# EAGLE design bmscableL431 (EAGLE 6.5.0)
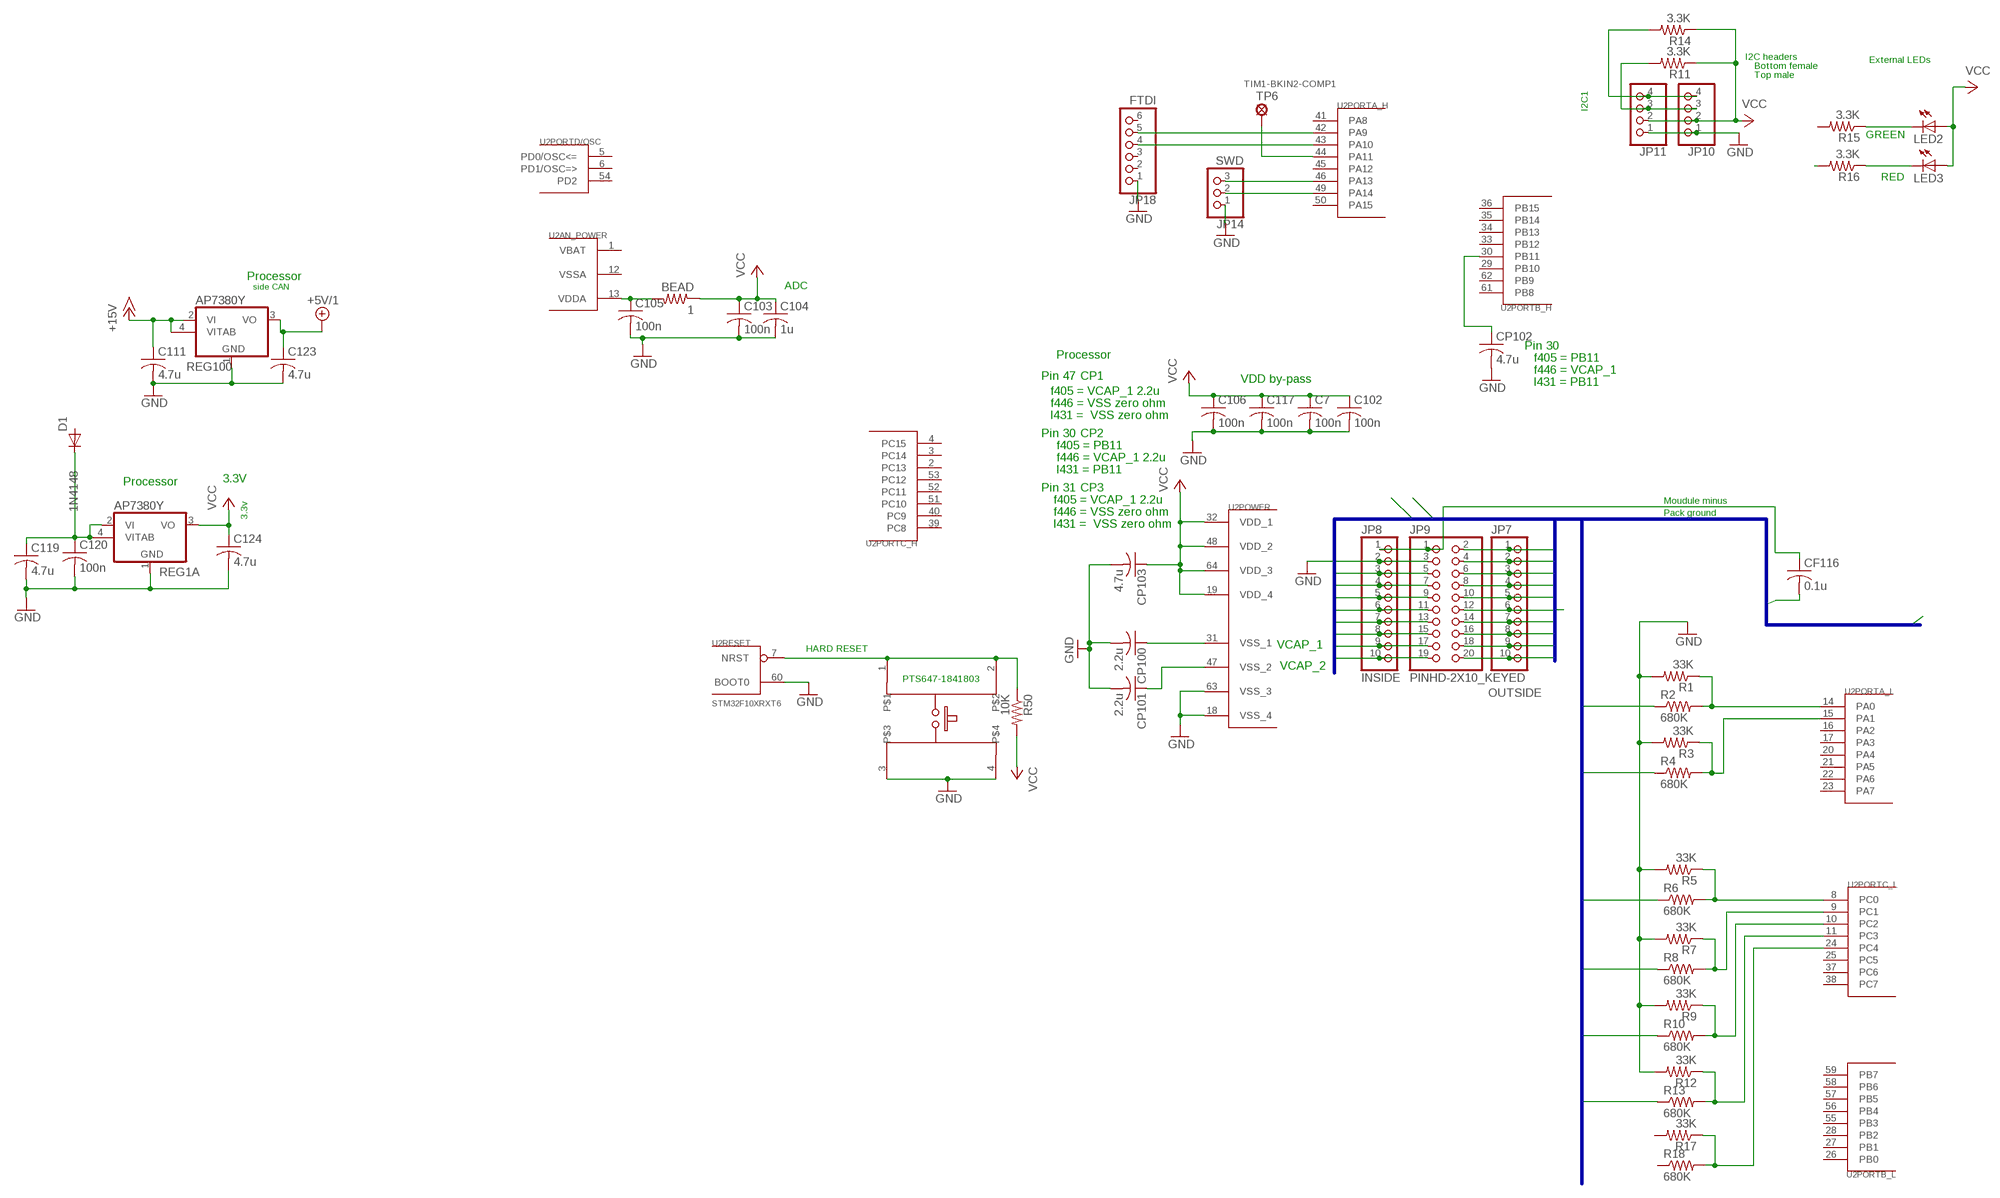
[diagram p0: schematic, sheet 1]

## Parts
BEAD  1  R-US_R0603  [R0603]
C7  100n  C-USC0603  [C0603]
C102  100n  C-USC0603  [C0603]
C103  100n  C-USC0603  [C0603]
C104  1u  C-USC0603  [C0603]
C105  100n  C-USC0603  [C0603]
C106  100n  C-USC0603  [C0603]
C111  4.7u  C-USC0603  [C0603]
C117  100n  C-USC0603  [C0603]
C119  4.7u  C-USC0603  [C0603]
C120  100n  C-USC0603  [C0603]
C123  4.7u  C-USC0603  [C0603]
C124  4.7u  C-USC0805  [C0805]
CF116  0.1u  C-USC0603  [C0603]
CP100  2.2u  C-USC0603  [C0603]
CP101  2.2u  C-USC0603  [C0603]
CP102  4.7u  C-USC0603  [C0603]
CP103  4.7u  C-USC0603  [C0603]
D1  1N4148  1N4004_VERT  [DO41-10_VERT]
JP7  OUTSIDE  PINHD-1X10  [1X10]
JP8  INSIDE  PINHD-1X10  [1X10]
JP9  PINHD-2X10_KEYED  [2X10_KEYED]
JP10  PINHD-1X4  [1X04]
JP11  PINHD-1X4  [1X04]
JP14  SWD  PINHD-1X3  [1X03]
JP18  FTDI  PINHD-1X6  [1X06]
LED2  LEDCHIP-LED0603  [CHIP-LED0603]
LED3  LEDCHIP-LED0603  [CHIP-LED0603]
R1  33K  R-US_R0603  [R0603]
R2  680K  R-US_R0603  [R0603]
R3  33K  R-US_R0603  [R0603]
R4  680K  R-US_R0603  [R0603]
R5  33K  R-US_R0603  [R0603]
R6  680K  R-US_R0603  [R0603]
R7  33K  R-US_R0603  [R0603]
R8  680K  R-US_R0603  [R0603]
R9  33K  R-US_R0603  [R0603]
R10  680K  R-US_R0603  [R0603]
R11  3.3K  R-US_R0603  [R0603]
R12  33K  R-US_R0603  [R0603]
R13  680K  R-US_R0603  [R0603]
R14  3.3K  R-US_R0603  [R0603]
R15  3.3K  R-US_R0603  [R0603]
R16  3.3K  R-US_R0603  [R0603]
R17  33K  R-US_R0603  [R0603]
R18  680K  R-US_R0603  [R0603]
R50  10K  R-US_R0603  [R0603]
REG1A  AP7380Y  [SOT89]
REG100  AP7380Y  [SOT89]
TP6  SOLDPAD0.6MM  [SOLPAD.6MM]
U2  STM32F10XRXT6  [TQFP64]
U$1  E-SWITCH2  [E-SWITCH2]

## Nets
+5V/1: C123.1 REG100.3(VO)
+15V: C111.1 REG100.2(VI) REG100.4(VITAB)
C0: JP7.2 JP9.4
C1: JP8.7 JP9.13
C2: JP8.3 JP9.5
C3: JP7.7 JP9.14 R4.1
C4: JP7.3 JP9.6
C5: JP8.8 JP9.15 R2.1
C6: JP8.4 JP9.7
C7: JP7.8 JP9.16 R13.1
C8: JP7.4 JP9.8
C9: JP8.9 JP9.17 R10.1
C10: JP8.5 JP9.9
C11: JP7.9 JP9.18 R8.1
C12: JP7.5 JP9.10
C13: JP8.10 JP9.19 R6.1
C14: JP8.6 JP9.11
C15: JP7.10 JP9.20
C16: JP7.6 JP9.12
GND: C7.2 C102.2 C103.2 C104.2 C105.2 C106.2 C111.2 C117.2 C119.2 C120.2 C123.2 C124.2 CP100.2 CP101.2 CP102.2 CP103.2 JP8.2 JP9.3 JP10.1 JP11.1 JP14.1 JP18.1 R1.2 R3.2 R5.2 R7.2 R9.2 R12.2 REG1A.1(GND) REG100.1(GND) U2.18(POWER:VSS_4) U2.60(RESET:BOOT0) U2.63(POWER:VSS_3) U$1.3 U$1.4
LED-EXT-GRN-CATHODE: LED2.C R15.1
LED-EXT-RED-CATHODE: LED3.C R16.1
NRST: R50.1 U2.7(RESET:NRST) U$1.1 U$1.2
PA0-C5-IN5: R1.1 R2.2 U2.14(PORTA_L:PA0)
PA1-C3-IN6: R3.1 R4.2 U2.15(PORTA_L:PA1)
PA9-USART1-TX: JP18.5 U2.42(PORTA_H:PA9)
PA10-USART1-RX: JP18.4 U2.43(PORTA_H:PA10)
PA13-SWDIO: JP14.3 U2.46(PORTA_H:PA13)
PA14-SWCLK: JP14.2 U2.49(PORTA_H:PA14)
PB1-LED-RED: R16.2
PB6-I2C1-SCL: JP10.4 JP11.4 R14.2
PB7-I2C2-SDA: JP10.3 JP11.3 R11.2
PB11-I2C2-SDA|VCAP1: CP102.1 U2.30(PORTB_H:PB11)
PC0-C13-IN1: R5.1 R6.2 U2.8(PORTC_L:PC0)
PC1-C11-IN2: R7.1 R8.2 U2.9(PORTC_L:PC1)
PC2-C9-IN3: R9.1 R10.2 U2.10(PORTC_L:PC2)
PC3-C7-IN4: R12.1 R13.2 U2.11(PORTC_L:PC3)
PC4-CX-IN13: R17.1 R18.2 U2.24(PORTC_L:PC4)
PGND_SRN_V: CF116.1 JP8.1 JP9.1
SRP: CF116.2 JP7.1 JP9.2
TIM1_BKIN2_COMP2: TP6.MP U2.44(PORTA_H:PA11)
V-ORED: C119.1 C120.1 D1.C REG1A.2(VI) REG1A.4(VITAB)
VCC: BEAD.1 C7.1 C102.1 C103.1 C104.1 C106.1 C117.1 C124.1 CP103.1 JP10.2 JP11.2 LED2.A LED3.A R11.1 R14.1 R50.2 REG1A.3(VO) U2.19(POWER:VDD_4) U2.32(POWER:VDD_1) U2.48(POWER:VDD_2) U2.64(POWER:VDD_3)
VDDA1: BEAD.2 C105.1 U2.13(AN_POWER:VDDA)
VSS_1-VCAP_1: CP100.1 U2.31(POWER:VSS_1)
VSS_3: CP101.1 U2.47(POWER:VSS_2)
Unconnected: D1.A JP18.2 JP18.3 JP18.6 R15.2 R17.2 R18.1 U2.2(PORTC_H:PC13) U2.3(PORTC_H:PC14) U2.4(PORTC_H:PC15) U2.5(PORTD/OSC:PD0/OSC<=) U2.6(PORTD/OSC:PD1/OSC=>) U2.16(PORTA_L:PA2) U2.17(PORTA_L:PA3) U2.20(PORTA_L:PA4) U2.21(PORTA_L:PA5) U2.22(PORTA_L:PA6) U2.23(PORTA_L:PA7) U2.25(PORTC_L:PC5) U2.26(PORTB_L:PB0) U2.27(PORTB_L:PB1) U2.28(PORTB_L:PB2) U2.29(PORTB_H:PB10) U2.33(PORTB_H:PB12) U2.34(PORTB_H:PB13) U2.35(PORTB_H:PB14) U2.36(PORTB_H:PB15) U2.37(PORTC_L:PC6) U2.38(PORTC_L:PC7) U2.39(PORTC_H:PC8) U2.40(PORTC_H:PC9) U2.41(PORTA_H:PA8) U2.45(PORTA_H:PA12) U2.50(PORTA_H:PA15) U2.51(PORTC_H:PC10) U2.52(PORTC_H:PC11) U2.53(PORTC_H:PC12) U2.54(PORTD/OSC:PD2) U2.55(PORTB_L:PB3) U2.56(PORTB_L:PB4) U2.57(PORTB_L:PB5) U2.58(PORTB_L:PB6) U2.59(PORTB_L:PB7) U2.61(PORTB_H:PB8) U2.62(PORTB_H:PB9)

## Buses
HDR$:PGND-SRN,SRP,VSS,C[0..16]

## Notes on the sheet
- I2C headers
- External LEDs
- Bottom female
- Top male
- TIM1-BKIN2-COMP1
- I2C1
- GREEN
- RED
- Processor
- side CAN | ADC
- Pin 30
- Processor | f405 = PB11
- f446 = VCAP_1
- Pin 47 | CP1 | VDD by-pass
- l431 = PB11
- f405 = VCAP_1 2.2u
- f446 = VSS zero ohm
- l431 =  VSS zero ohm
- Pin 30 | CP2
- f405 = PB11
- f446 = VCAP_1 2.2u
- l431 = PB11
- Processor | 3.3V
- Pin 31 | CP3
- 3.3v
- f405 = VCAP_1 2.2u | Moudule minus
- f446 = VSS zero ohm | Pack ground
- l431 =  VSS zero ohm
- VCAP_1
- HARD | RESET
- VCAP_2
- PTS647-1841803

## Power pins joined to a net without a drawn wire
VBAT: U2.1(AN_POWER:VBAT)
VSSA: U2.12(AN_POWER:VSSA)

## Library data of the parts
BEAD R1-R18 R50 = rcl:R-US_: RESISTOR, American symbol
C7 C102-C106 C111 C117 C119 C120 C123 C124 CF116 CP100-CP103 = rcl:C-US: CAPACITOR, American symbol
D1 = diode:1N4004_VERT
JP7 JP8 = pinhead:PINHD-1X10: PIN HEADER
JP9 = pinhead:PINHD-2X10_KEYED
JP10 JP11 = pinhead:PINHD-1X4: PIN HEADER
JP14 = pinhead:PINHD-1X3: PIN HEADER
JP18 = pinhead:PINHD-1X6: PIN HEADER
LED2 LED3 = led:LED: LED OSRAM: - CHIPLED LG R971, LG N971, LY N971, LG Q971, LY Q971, LO R971, LY R971 LH N974, LH R974 LS Q976, LO Q976, LY Q976 LO Q996 - Hyper CHIPLED LW Q18S LB Q993, LB Q99A, LB R99A - SideLED LS A670, LO A670, LY A670, LG A670, LP A670 LB A673, LV A673, LT A673, LW A673 LH A674 LY A675 LS A676, LA A676, LO A676, LY A676, LW A676 LS A679, LY A679, LG A679 - Hyper Micro SIDELED® LS Y876, LA Y876, LO Y876, LY Y876 LT Y87S - SmartLED LW L88C, LW L88S LB L89C, LB L89S, LG L890 LS L89K, LO L89K, LY L89K LS L896, LA L896, LO L896, LY L896 - TOPLED LS T670, LO T670, LY T670, LG T670, LP T670 LSG T670, LSP T670, LSY T670, LOP T670, LYG T670 LG T671, LOG T671, LSG T671 LB T673, LV T673, LT T673, LW T673 LH T674 LS T676, LA T676, LO T676, LY T676, LB T676, LH T676, LSB T676, LW T676 LB T67C, LV T67C, LT T67C, LS T67K, LO T67K, LY T67K, LW E67C LS E67B, LA E67B, LO E67B, LY E67B, LB E67C, LV E67C, LT E67C LW T67C LS T679, LY T679, LG T679 LS T770, LO T770, LY T770, LG T770, LP T770 LB T773, LV T773, LT T773, LW T773 LH T774 LS E675, LA E675, LY E675, LS T675 LS T776, LA T776, LO T776, LY T776, LB T776 LHGB T686 LT T68C, LB T68C - Hyper Mini TOPLED® LB M676 - Mini TOPLED Santana® LG M470 LS M47K, LO M47K, LY M47K Source: http://www.osram.convergy.de/
REG1A REG100 = linear:AP7380Y
TP6 = solpad:SOLDPAD0.6MM
U2 = stm32:STM32F10XRXT6: STM32F101/103 64pin LQFP
U$1 = switch-misc:E-SWITCH2

## Board
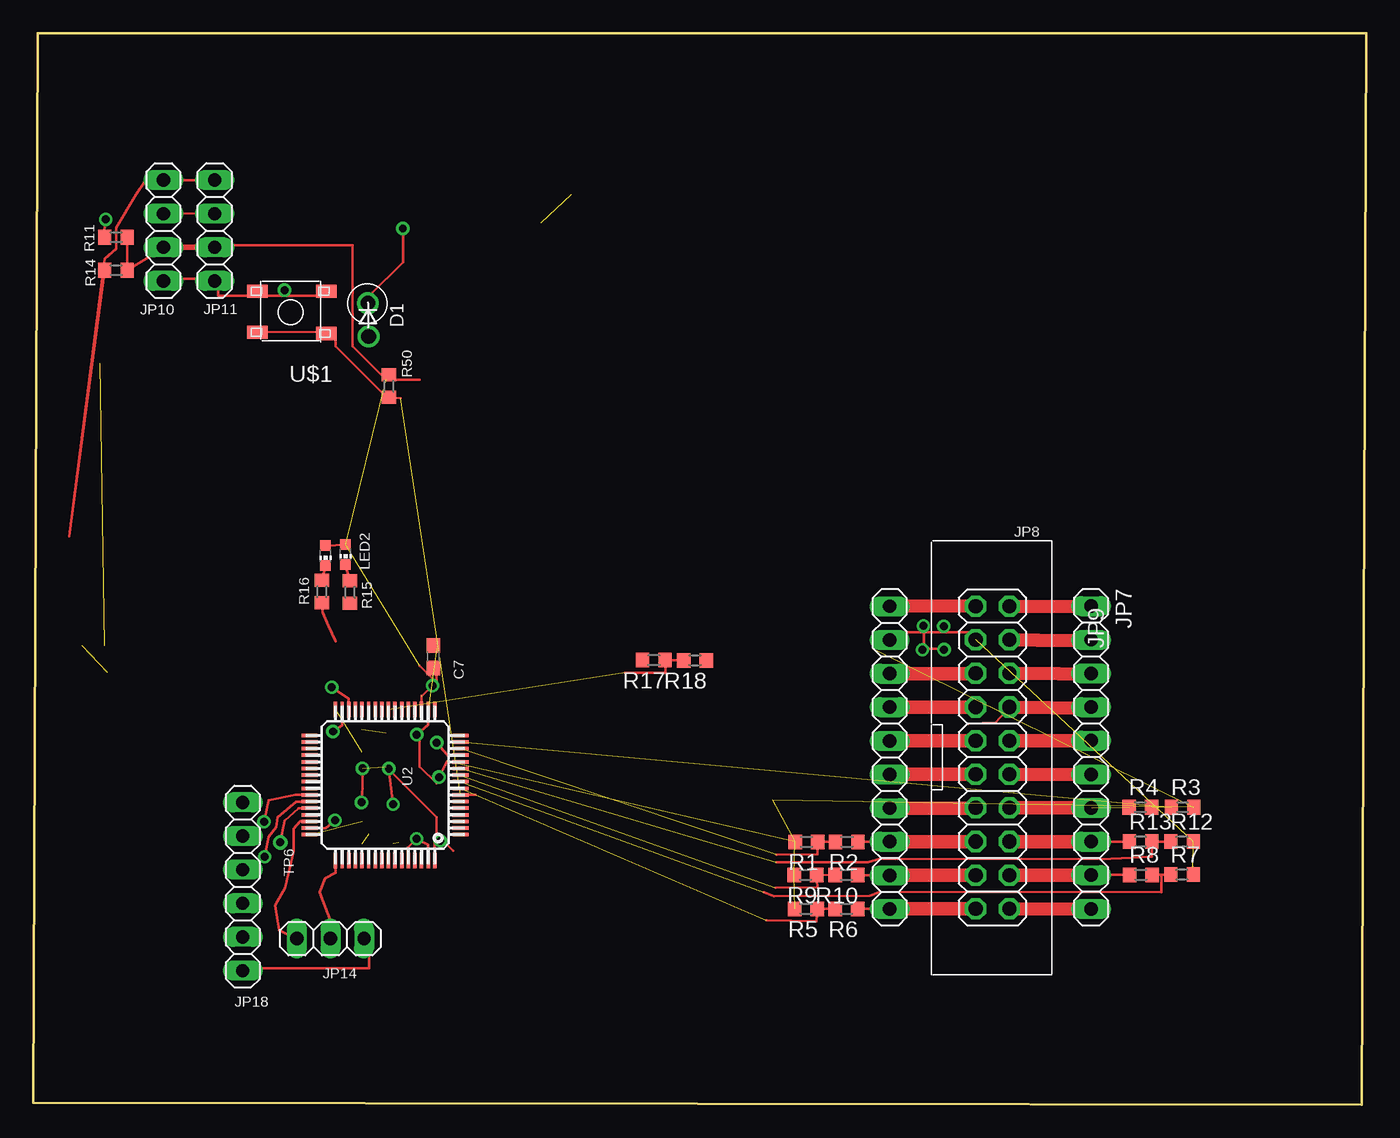
[diagram p1: board, top side]
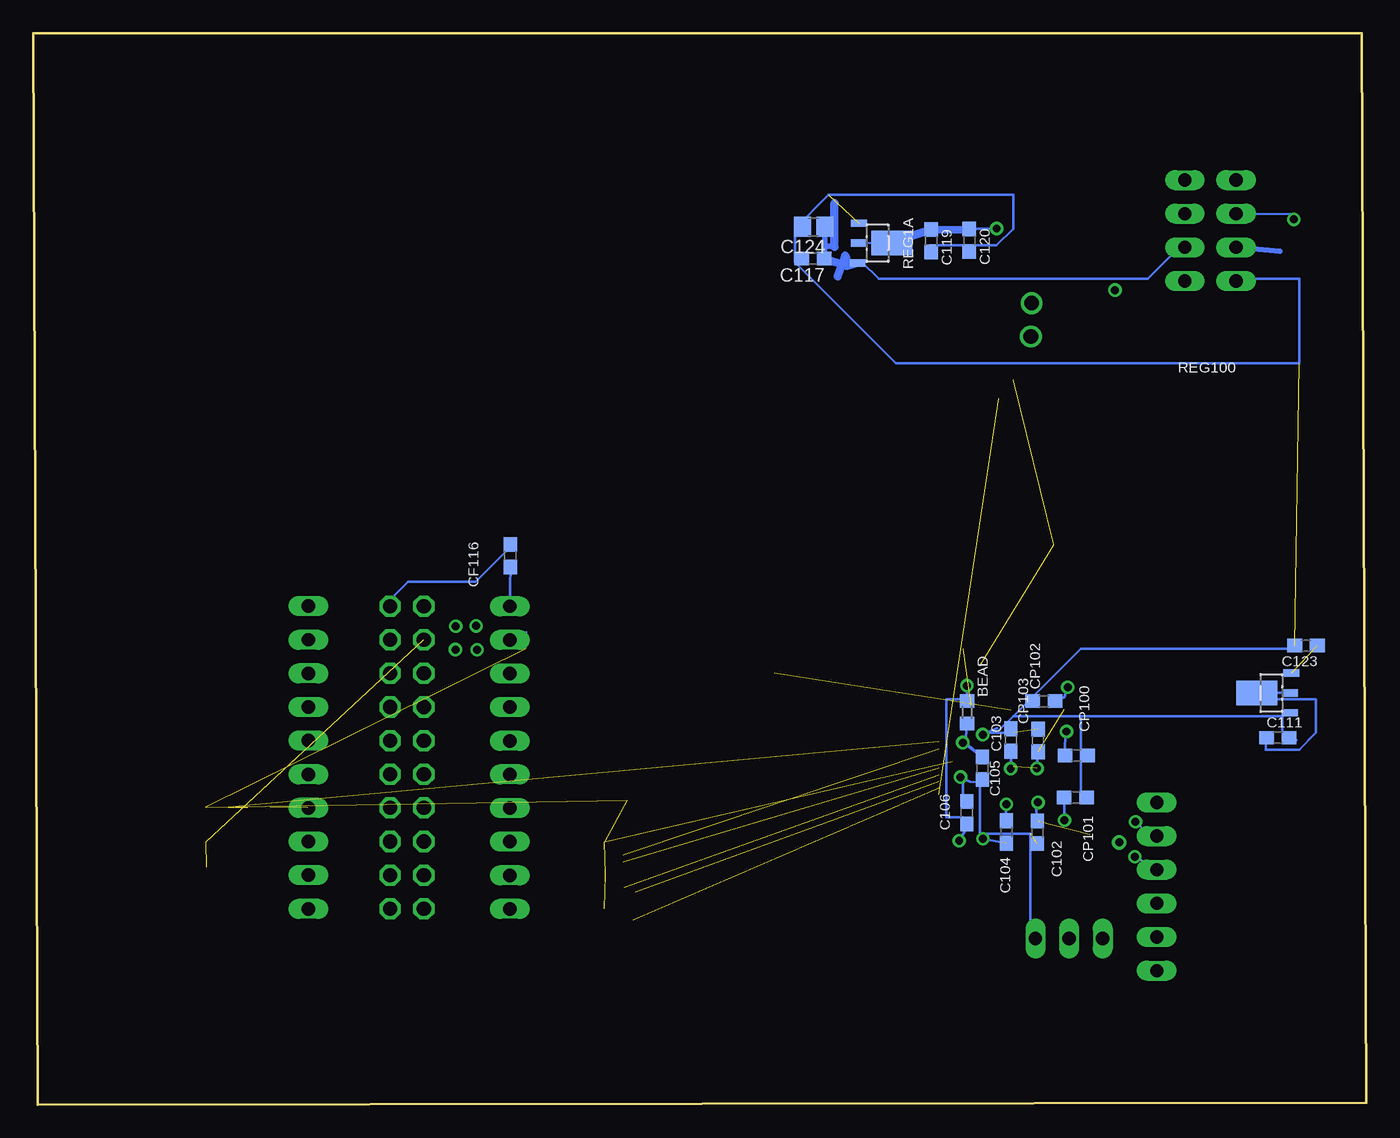
[diagram p2: board, bottom side, seen from below]

Size 100.74 x 80.95 mm. Coordinates in mm from the lower left corner, seen from the top.
Outline: 0,0.15 0.37,80.95 100.74,80.92 100.38,0 0,0.15
Copper layers (1*16): Top 0.035mm / dielectric 1.5mm / Bottom 0.035mm
Design rules "default": minimum track width 8mil, minimum drill 0.6mm, track to track 8mil, track to pad 8mil, pad to pad 8mil, via to via 8mil, smd to smd 0mil, copper to edge 8mil, drill to drill 8mil, minimum pad ring 10mil, minimum via ring 8mil, stop-mask expansion 4mil, vias tented up to drill 0mil, thermal gap 10mil

### Footprints (pad centres in the part's own frame; a part is rotated, then mirrored left to right if it is on the bottom)
R0603 = smd 1 x 1.1: 1 -0.85,0; 2 0.85,0
C0603 = smd 1.1 x 1: 1 -0.85,0; 2 0.85,0
C0805 = smd 1.3 x 1.5: 1 -0.85,0; 2 0.85,0
DO41-10_VERT = drill 1.1: A 2.58,0.05; C 0.07,0
1X10 = drill 1.016 long: 1 -11.43,0; 2 -8.89,0; 3 -6.35,0; 4 -3.81,0; 5 -1.27,0; 6 1.27,0; 7 3.81,0; 8 6.35,0; 9 8.89,0; 10 11.43,0
2X10_KEYED = drill 1.067 octagon: 1 -11.46,-1.27; 2 -11.46,1.27; 3 -8.92,-1.27; 4 -8.92,1.27; 5 -6.38,-1.27; 6 -6.38,1.27; 7 -3.84,-1.27; 8 -3.84,1.27; 9 -1.3,-1.27; 10 -1.3,1.27; 11 1.24,-1.27; 12 1.24,1.27; 13 3.78,-1.27; 14 3.78,1.27; 15 6.32,-1.27; 16 6.32,1.27; 17 8.86,-1.27; 18 8.86,1.27; 19 11.4,-1.27; 20 11.4,1.27
1X04 = drill 1 long: 1 -3.81,0; 2 -1.27,0; 3 1.27,0; 4 3.81,0
1X03 = drill 1 long: 1 -2.54,0; 2 0,0; 3 2.54,0
1X06 = drill 1 long: 1 -6.35,0; 2 -3.81,0; 3 -1.27,0; 4 1.27,0; 5 3.81,0; 6 6.35,0
CHIP-LED0603 = smd 0.8 x 0.8: A 0,-0.75; C 0,0.75
SOT89 = smd 0.55 x 1.2: 1 -1.5,-1.4; 2 0,-1.4; 3 1.5,-1.5 | smd 1.85 x 3.1: 4 0,1.1
SOLPAD.6MM = drill 0.6 pad 1.1: MP 0,0
TQFP64 = smd 1.2 x 0.26: 1 -5.7,3.75; 2 -5.7,3.25; 3 -5.7,2.75; 4 -5.7,2.25; 5 -5.7,1.75; 6 -5.7,1.25; 7 -5.7,0.75; 8 -5.7,0.25; 9 -5.7,-0.25; 10 -5.7,-0.75; 11 -5.7,-1.25; 12 -5.7,-1.75; 13 -5.7,-2.25; 14 -5.7,-2.75; 15 -5.7,-3.25; 16 -5.7,-3.75; 33 5.7,-3.75; 34 5.7,-3.25; 35 5.7,-2.75; 36 5.7,-2.25; 37 5.7,-1.75; 38 5.7,-1.25; 39 5.7,-0.75; 40 5.7,-0.25; 41 5.7,0.25; 42 5.7,0.75; 43 5.7,1.25; 44 5.7,1.75; 45 5.7,2.25; 46 5.7,2.75; 47 5.7,3.25; 48 5.7,3.75 | smd 0.26 x 1.2: 17 -3.75,-5.7; 18 -3.25,-5.7; 19 -2.75,-5.7; 20 -2.25,-5.7; 21 -1.75,-5.7; 22 -1.25,-5.7; 23 -0.75,-5.7; 24 -0.25,-5.7; 25 0.25,-5.7; 26 0.75,-5.7; 27 1.25,-5.7; 28 1.75,-5.7; 29 2.25,-5.7; 30 2.75,-5.7; 31 3.25,-5.7; 32 3.75,-5.7; 49 3.75,5.7; 50 3.25,5.7; 51 2.75,5.7; 52 2.25,5.7; 53 1.75,5.7; 54 1.25,5.7; 55 0.75,5.7; 56 0.25,5.7; 57 -0.25,5.7; 58 -0.75,5.7; 59 -1.25,5.7; 60 -1.75,5.7; 61 -2.25,5.7; 62 -2.75,5.7; 63 -3.25,5.7; 64 -3.75,5.7
E-SWITCH2 = smd 1.55 x 1: 1 -2.7,1.6; 2 2.5,1.5; 3 2.5,-1.6; 4 -2.7,-1.6

### Placement (x,y rotation side)
BEAD  30.18,29.65 270 bottom
C7  30.24,33.86 90 top
C102  24.86,20.58 270 bottom
C103  26.86,27.56 90 bottom
C104  27.21,20.61 270 bottom
C105  29.02,25.41 270 bottom
C106  30.19,22.07 90 bottom
C111  6.68,27.73 0 bottom
C117  41.82,63.92 180 bottom
C119  32.89,65.26 270 bottom
C120  30.01,65.3 270 bottom
C123  4.56,34.69 180 bottom
C124  41.77,66.32 180 bottom
CF116  64.68,41.49 90 bottom
CP100  21.93,26.39 0 bottom
CP101  22,23.21 0 bottom
CP102  24.36,30.5 180 bottom
CP103  24.81,27.52 90 bottom
D1  25.3,60.62 270 top
JP7  79.93,26.24 270 top
JP8  64.73,26.23 270 top
JP9  72.49,26.21 270 top
JP10  9.84,66.04 90 top
JP11  13.72,66.04 90 top
JP14  22.47,12.56 180 top
JP18  15.84,16.49 90 top
LED2  23.61,41.57 180 top
LED3  22.09,41.49 180 top
R1  58.43,19.87 180 top
R2  61.48,19.87 180 top
R3  86.85,22.48 0 top
R4  83.66,22.48 0 top
R5  58.4,14.8 180 top
R6  61.45,14.8 180 top
R7  86.81,17.39 0 top
R8  83.7,17.37 0 top
R9  58.35,17.37 180 top
R10  61.45,17.35 180 top
R11  6.27,65.53 180 top
R12  86.81,19.88 0 top
R13  83.68,19.88 0 top
R14  6.27,63.04 180 top
R15  23.94,38.73 270 top
R16  21.82,38.77 270 top
R17  46.9,33.59 180 top
R18  50.01,33.57 180 top
R50  26.88,54.29 90 top
REG1A  36.94,65.09 270 bottom
REG100  7.18,31.11 90 bottom
TP6  18.68,19.82 270 top
U2  26.6,24.16 180 top
U$1  19.46,59.86 180 top

### Tracks (layer width: path | path; a pad name or v marks a point on that pad's centre or on a via)
+5V/1  (1 unrouted)
  Bottom 0.203: C123.1 3.37,34.71
  Bottom 0.406: C123.1 3.37,34.66 | REG100.3 5.65,32.62
+15V
  Bottom 0.203: REG100.2 8.3,31.13 REG100.4 7.62,30.63 3.81,30.63 3.81,28.09 5.08,26.82 7.62,26.82 7.62,28.09 C111.1
C0
  Top 0.61: 75.9,35.11 75.9,35.06 75.66,35.03
  Top 1.016: JP7.2 79.96,35.07 75.9,35.11 JP9.4
C1
  Top 0.203: 64.77,22.41 JP8.7
  Top 1.016: JP9.13 71.25,22.42 JP8.7
C2
  Top 1.016: JP9.5 JP8.3
C3  (1 unrouted)
  Top 1.016: 79.98,22.43 JP7.7 JP9.14
C4
  Top 0.203: 77.52,32.56 77.52,32.51 76.98,32.55
  Top 1.016: JP7.3 79.94,32.54 77.52,32.56 JP9.6
C5
  Top 0.203: 64.85,19.83 JP8.8 R2.1
  Top 1.016: JP9.15 71.27,19.88 JP8.8
C6
  Top 0.203: 64.81,30.04 JP8.4
  Top 1.016: JP9.7 71.25,30.03 JP8.4
C7
  Top 0.203: 73.81,19.9 JP9.16 | R13.1 JP7.8
  Top 1.016: JP7.8 79.98,19.88 JP9.16
C8
  Top 0.203: 70.67,28.79 72.7,28.88 73.92,30.17 JP9.8
  Top 1.016: JP7.4 79.98,29.97 JP9.8
C9
  Top 0.203: 64.81,17.39 JP8.9 R10.1
  Top 1.016: JP9.17 JP8.9
C10
  Top 0.203: 64.81,27.53 JP8.5
  Top 1.016: JP9.9 71.27,27.5 JP8.5
C11
  Top 0.203: 73.71,17.42 JP9.18 | R8.1 79.93,17.37 JP7.9
  Top 1.016: JP7.9 80,17.33 JP9.18
C12
  Top 0.203: 76.04,27.5 76.04,27.45 76.02,27.46
  Top 1.016: JP7.5 79.98,27.49 76.04,27.5 JP9.10
C13
  Top 0.203: 64.75,14.72 JP8.10 R6.1
  Top 1.016: JP9.19 71.25,14.8 JP8.10
C14
  Top 0.203: 69.05,24.96 69.05,24.99 69.01,24.97
  Top 1.016: JP9.11 71.25,24.96 69.05,24.96 JP8.6
C15
  Top 1.016: JP7.10 80.03,14.78 JP9.20
  Bottom 0.203: 73.85,14.88 JP9.20
C16
  Top 0.406: 79.88,25.06 JP7.6
  Top 1.016: JP7.6 79.96,24.92 JP9.12
GND  (via drill 0.6)  (14 unrouted)
  Top 0.203: U2.18 29.83,28.72 v28.99,27.97 29.21,28.09 29.21,25.55 30.48,24.28 v30.66,24.76 31.29,25.94 | U2.60 28.29,19.43 v28.98,20.1 29.14,20 29.86,19.63 U2.63 | 67.31,35.71 67.31,34.44 | 67.31,34.44 68.58,34.44 v68.83,34.39 | 67.31,34.44 v67.2,34.38 | 67.31,35.71 68.58,35.71 | 68.58,35.71 71.12,35.71 JP9.3 | 68.58,35.71 v68.81,36.15 | 63.5,34.44 63.5,35.71 JP8.2 64.77,35.71 67.31,35.71 | 30.48,34.44 C7.2 | 87.63,17.93 R7.2 | 67.31,35.71 v67.27,36.18 | JP18.1 16.51,10.31 25.4,10.31 25.4,11.58 JP14.1 | 16.51,61.11 19.05,61.11 | 19.05,61.11 21.59,61.11 U$1.4 | 19.05,61.11 v18.99,61.54 | JP10.1 10.16,62.38 12.7,62.38 JP11.1 13.97,62.38 13.97,61.11 16.51,61.11 | 16.51,61.11 U$1.3
  Bottom 0.203: 27.91,28.43 v28.99,27.97 29.21,28.09 27.94,28.09 | 27.6,19.83 v28.98,20.1 29.21,20.47 | 5.31,27.54 C111.2 6.35,28.09 6.35,29.36 | 21.59,26.82 21.59,23.01 CP101.2 | C106.2 30.48,23.01 30.48,24.28 v30.66,24.76 29.96,24.39 29.26,24.36 C105.2 29.21,24.28 29.21,20.47 | 27.94,28.09 26.67,28.09 C103.2 | 27.94,28.09 26.67,29.36 | 26.67,29.36 25.4,30.63 | 26.67,29.36 21.59,29.36 | 21.59,29.36 6.35,29.36 | 6.35,29.36 REG100.1 | 21.59,29.36 21.59,26.82 | 21.59,26.82 CP100.2 | 29.21,20.47 25.4,20.47 25.4,12.85 JP14.1 | 30.48,64.92 33.02,64.92 C119.2 | 43.18,66.19 43.18,63.65 | 30.48,64.92 27.94,64.92 26.67,66.19 26.67,68.73 40.64,68.73 43.18,66.19 | 30.48,64.92 C120.2 | 43.18,66.19 C124.2 | JP10.1 8.89,62.38 5.08,62.38 5.08,56.03 35.56,56.03 43.18,63.65 | 43.18,63.65 C117.2 | 25.4,30.63 21.59,34.44 5.08,34.44 C123.2 | 25.4,30.63 CP102.2 | 63.5,35.71 JP8.2
LED-EXT-GRN-CATHODE
  Top 0.203: LED2.C 23.59,40.8 R15.1
LED-EXT-RED-CATHODE
  Top 0.203: LED3.C 22.1,40.63 R16.1
NRST  (1 unrouted)
  Top 0.203: 33.44,23.42 U2.7 | 27.77,53.38 R50.1 26.67,53.49 22.86,57.3 22.86,58.57 U$1.1 22.21,58.4 U$1.2
PA0-C5-IN5  (1 unrouted)
  Top 0.203: R2.2 R1.1 59.28,18.92 56.18,18.91
PA1-C3-IN6  (2 unrouted)
PA9-USART1-TX  (via drill 0.6)
  Top 0.203: U2.42 19.83,23.41 17.8,22.99 v17.45,21.39
  Bottom 0.203: JP18.5 15.73,20.32 16.72,20.72 v17.45,21.39
PA10-USART1-RX  (via drill 0.6)
  Top 0.203: U2.43 19.89,22.91 18.49,21.72 18.35,20.98 17.78,20.25 v17.49,18.74
  Bottom 0.203: JP18.4 15.74,17.76 v17.49,18.74
PA13-SWDIO
  Top 0.203: U2.46 20.19,21.42 19.69,20.85 19.67,19.14 19.04,16.39 18.28,15.08 18.59,13.2 19.94,12.52 JP14.3
PA14-SWCLK
  Top 0.203: U2.49 22.84,17.55 22.06,17.13 21.66,16.06 22.54,13.67 JP14.2
PB1-LED-RED
  Top 0.203: 22.86,35.03 22.33,36.14 21.87,37.19 21.83,37.89 R16.2
PB6-I2C1-SCL
  Top 0.203: 13.69,69.82 JP11.4 9.79,69.82 JP10.4 9.88,69.87 8.51,69.84 7.79,68.76 6.28,66.24 6.28,64.68 5.43,63.92 2.73,42.95 R14.2 5.57,63.07
PB7-I2C2-SDA  (via drill 0.6)
  Top 0.203: 13.8,67.32 JP11.3 9.87,67.34 JP10.3 9.87,67.31 | R11.2 5.3,65.5 v5.49,66.88
  Bottom 0.203: JP10.3 5.66,67.26 v5.49,66.88
PB11-I2C2-SDA|VCAP1  (via drill 0.6)
  Top 0.203: v22.57,31.54 23.85,30.66 U2.30
  Bottom 0.203: CP102.1 22.82,30.77 v22.57,31.54
PC0-C13-IN1  (1 unrouted)
  Top 0.203: R6.2 R5.1 59.2,13.87 55.43,13.95
PC1-C11-IN2  (1 unrouted)
  Top 0.203: R7.1 84.55,17.39 R8.2 85.25,17.37 85.25,16.05 80.6,16.09 63.9,16.07 63.23,15.78 55.98,15.76 55.22,16.07
PC2-C9-IN3  (1 unrouted)
  Top 0.203: R10.2 R9.1 59.28,16.43 56.11,16.41
PC3-C7-IN4  (1 unrouted)
  Top 0.203: R12.1 R13.2 84.52,18.74 80.66,18.57 63.98,18.6 63.06,18.32 56.15,18.33
PC4-CX-IN13  (1 unrouted)
  Top 0.203: R18.2 R17.1 47.78,32.63 44.73,32.64
PGND_SRN_V
  Top 1.016: JP9.1 71.25,37.68 JP8.1
  Bottom 0.203: CF116.1 64.73,37.63 JP8.1
SRP
  Top 1.016: JP7.1 79.96,37.64 JP9.2
  Bottom 0.203: CF116.2 64.77,42.06 67.31,39.52 72.39,39.52 73.66,38.25 JP9.2
TIM1_BKIN2_COMP2
  Top 0.203: U2.44 20.07,22.41 19.02,21.45 TP6.MP
V-ORED  (via drill 0.6)
  Top 0.203: v27.94,66.19 27.94,63.65 25.4,61.11 D1.C
  Bottom 0.203: REG1A.2 37.01,65.13 35.85,65.07 REG1A.4 | v27.94,66.19 30.48,66.19 C120.1
  Bottom 0.61: C119.1 32.92,66.09 | 32.92,66.09 C120.1 | REG1A.4 35.85,65.11 32.92,66.09
VCC  (via drill 0.6)  (7 unrouted)
  Top 0.203: U2.64 30.34,19.78 v30.77,19.95 | U2.19 29.35,30.88 v30.18,31.67 30.48,31.9 | v27.2,22.7 v26.88,25.4 26.67,25.55 30.48,21.74 30.48,20.47 31.75,19.2 | v24.89,25.41 24.9,24.08 v24.81,22.85 | LED3.A 23.61,42.29 LED2.A 23.56,42.33 | 9.87,64.78 JP10.2 9.9,64.75 R14.1 R11.1 | 29.34,29.36 29.34,30.9 | 30.48,31.9 30.48,33.17 C7.1 | 29.21,54.76 26.67,54.76 | 30.48,31.9 29.21,33.17 | 26.67,54.76 24.13,57.3 24.13,64.92 13.97,64.92 JP11.2 | 26.67,54.76 R50.2
  Top 0.406: 9.87,64.78 JP11.2
  Bottom 0.203: v30.77,19.95 30.26,20.83 C106.1 30.48,21.74 31.75,21.74 31.75,30.63 30.48,30.63 BEAD.1 30.2,30.51 v30.18,31.67 | C103.1 v26.88,25.4 | C104.1 27.24,22.11 v27.2,22.7 | CP103.1 v24.89,25.41 | C102.1 24.94,22.26 v24.81,22.85 | REG1A.3 38.1,63.65 36.83,62.38 16.51,62.38 13.97,64.92 JP11.2
  Bottom 0.406: C117.1 40.92,64.84 | 40.92,64.84 40.27,64.86 | C124.1 40.87,66.39 40.92,64.84 | JP10.2 9.87,64.77 6.55,64.46
  Bottom 0.61: 39.25,63.35 C117.1 | 39.96,62.58 39.38,64.17 39.25,63.35 | 40.27,64.86 40.19,64.8 40.18,68.1 | 39.25,63.35 39.23,63.38 REG1A.3
VDDA1  (via drill 0.6)
  Top 0.203: U2.13 31.32,26.41 v30.5,27.36
  Bottom 0.203: BEAD.2 30.3,27.24 C105.1 30.31,27.36 v30.5,27.36
VSS_1-VCAP_1  (via drill 0.6)
  Top 0.203: U2.31 23.35,28.67 v22.66,28.2
  Bottom 0.203: CP100.1 22.78,27.22 v22.66,28.2
VSS_3  (via drill 0.6)
  Top 0.203: U2.47 22.1,20.91 v22.81,21.5
  Bottom 0.203: CP101.1 22.79,21.53 v22.81,21.5

### Text on the board
tValues: 3.3V | DIGITAL | +5V | 3.2v | ANALOG | 3.2